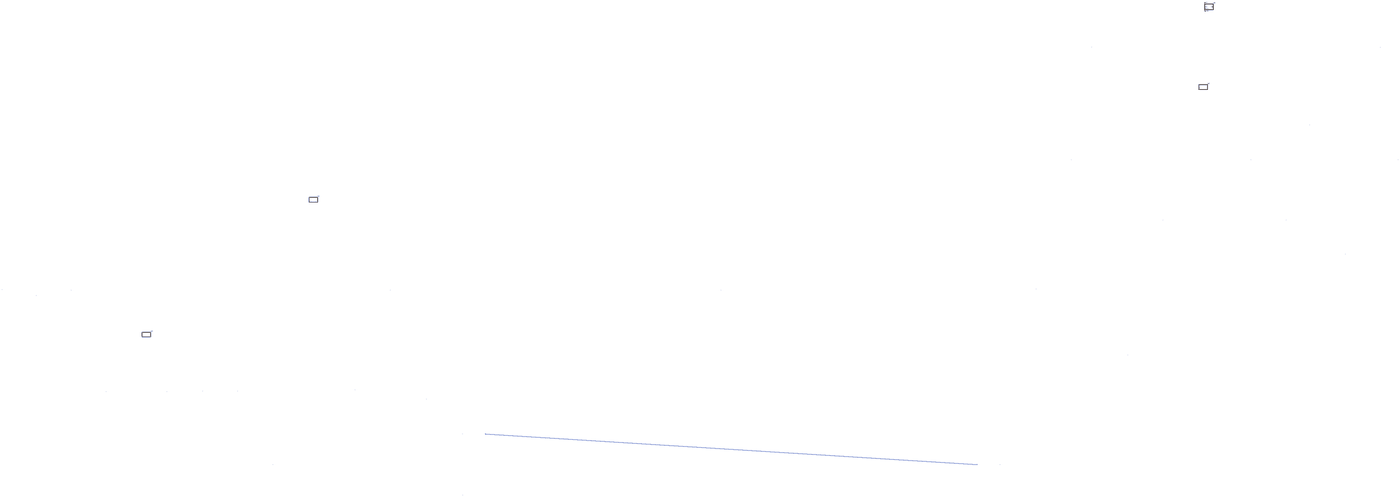
[diagram p0: schematic TOP.asc, whole sheet]
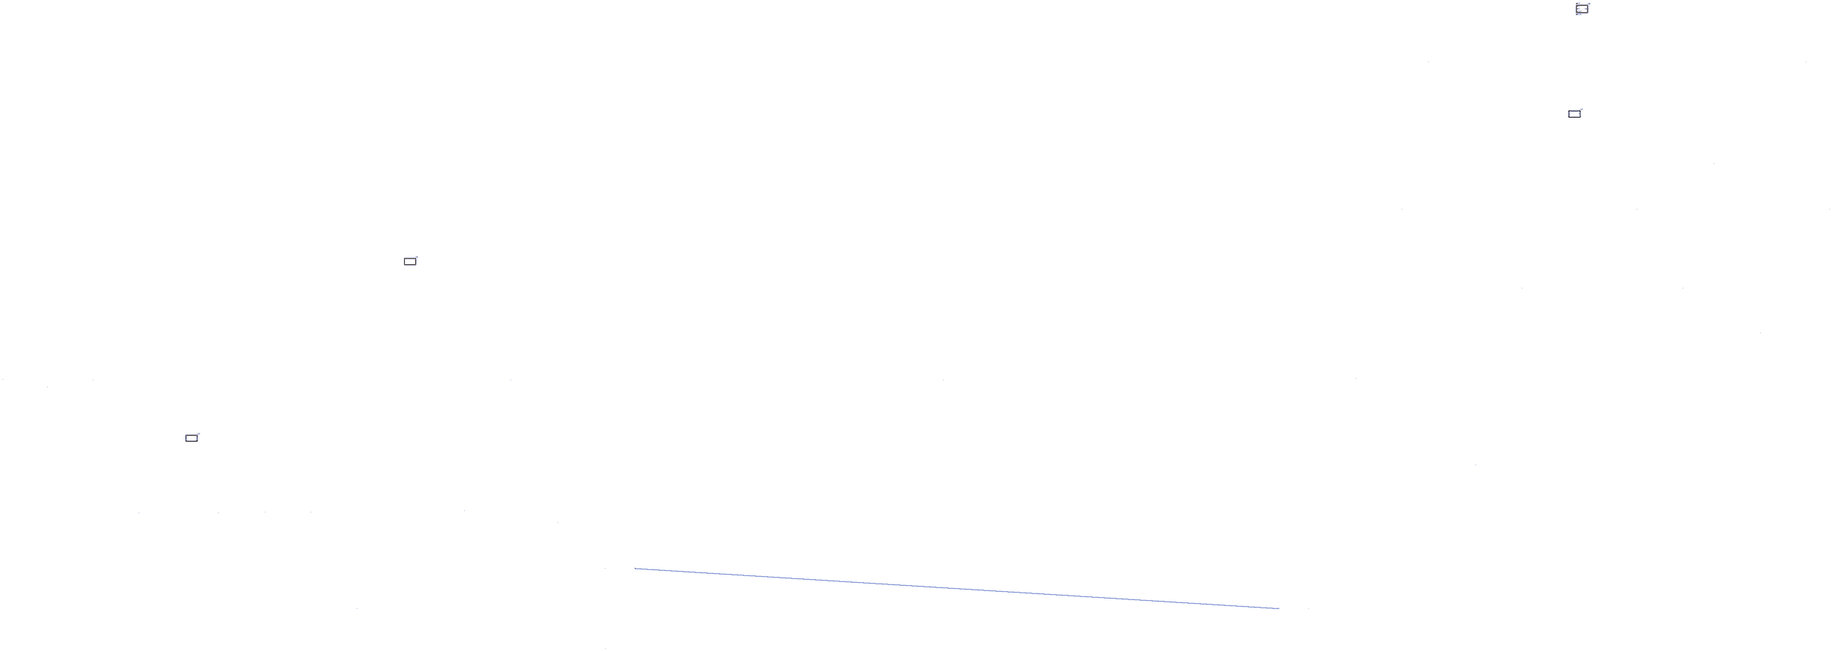
[diagram p1: schematic TOP.asc, part, row 1 of 1, column 1 of 1]
TOP.asc, the LTspice schematic file:
Version 4
Sheet 1 880 680
SYMBOL AND 42736 1040 R0
SYMATTR InstName U0
SYMBOL BUF 42645 7520 R0
SYMATTR InstName U2
SYMBOL DUT 9720 19040 R0
SYMATTR InstName U3
SYMBOL NOT 15295 13280 R0
SYMATTR InstName U1
WIRE 33226 17166 33226 17166
WIRE 39733 19360 39733 19360
WIRE 45520 11426 45520 11426
WIRE 49599 13600 49599 13600
WIRE 53640 11426 53640 11426
WIRE 53360 5666 53360 5666
WIRE 41406 13600 41406 13600
WIRE 37520 11426 37520 11426
WIRE 37840 5662 37840 5662
WIRE 10040 23309 10040 23309
WIRE 7000 23309 7000 23309
WIRE 5780 17186 5780 17186
WIRE 14080 25520 14080 25520
WIRE 22597 26000 22597 26000
WIRE 26640 17186 26640 17186
WIRE 22591 25040 22591 25040
WIRE 18160 17186 18160 17186
WIRE 52726 15793 52726 15793
WIRE 49966 10033 49966 10033
WIRE 11120 23301 11120 23301
WIRE 12200 23298 12200 23298
WIRE 4080 17268 4080 17268
WIRE 2380 17176 2380 17176
WIRE 19326 23424 19326 23424
WIRE 17033 23283 17033 23283
WIRE 31010 25520 31010 25520
WIRE 22951 25040 30650 25520
WIRE 22951 25040 30650 25520
WIRE 22951 25040 30650 25520
WIRE 22951 25040 30650 25520
WIRE 22951 25040 30650 25520
WIRE 22951 25040 30650 25520
WIRE 22951 25040 30650 25520
WIRE 22951 25040 30650 25520
WIRE 22951 25040 30650 25520
WIRE 22951 25040 30650 25520
WIRE 22951 25040 30650 25520
WIRE 22951 25040 30650 25520

The netlist it stands for:
* TOP.asc
XU0 NC_01 NC_02 NC_03 NC_04 NC_05 NC_06 AND  ; pins VDD VSS in1 in2 in3 out
XU2 BUF
XU3 DUT
XU1 NOT
.backanno
.end